# EAGLE schematic X8R analog sensor (EAGLE 6.4)
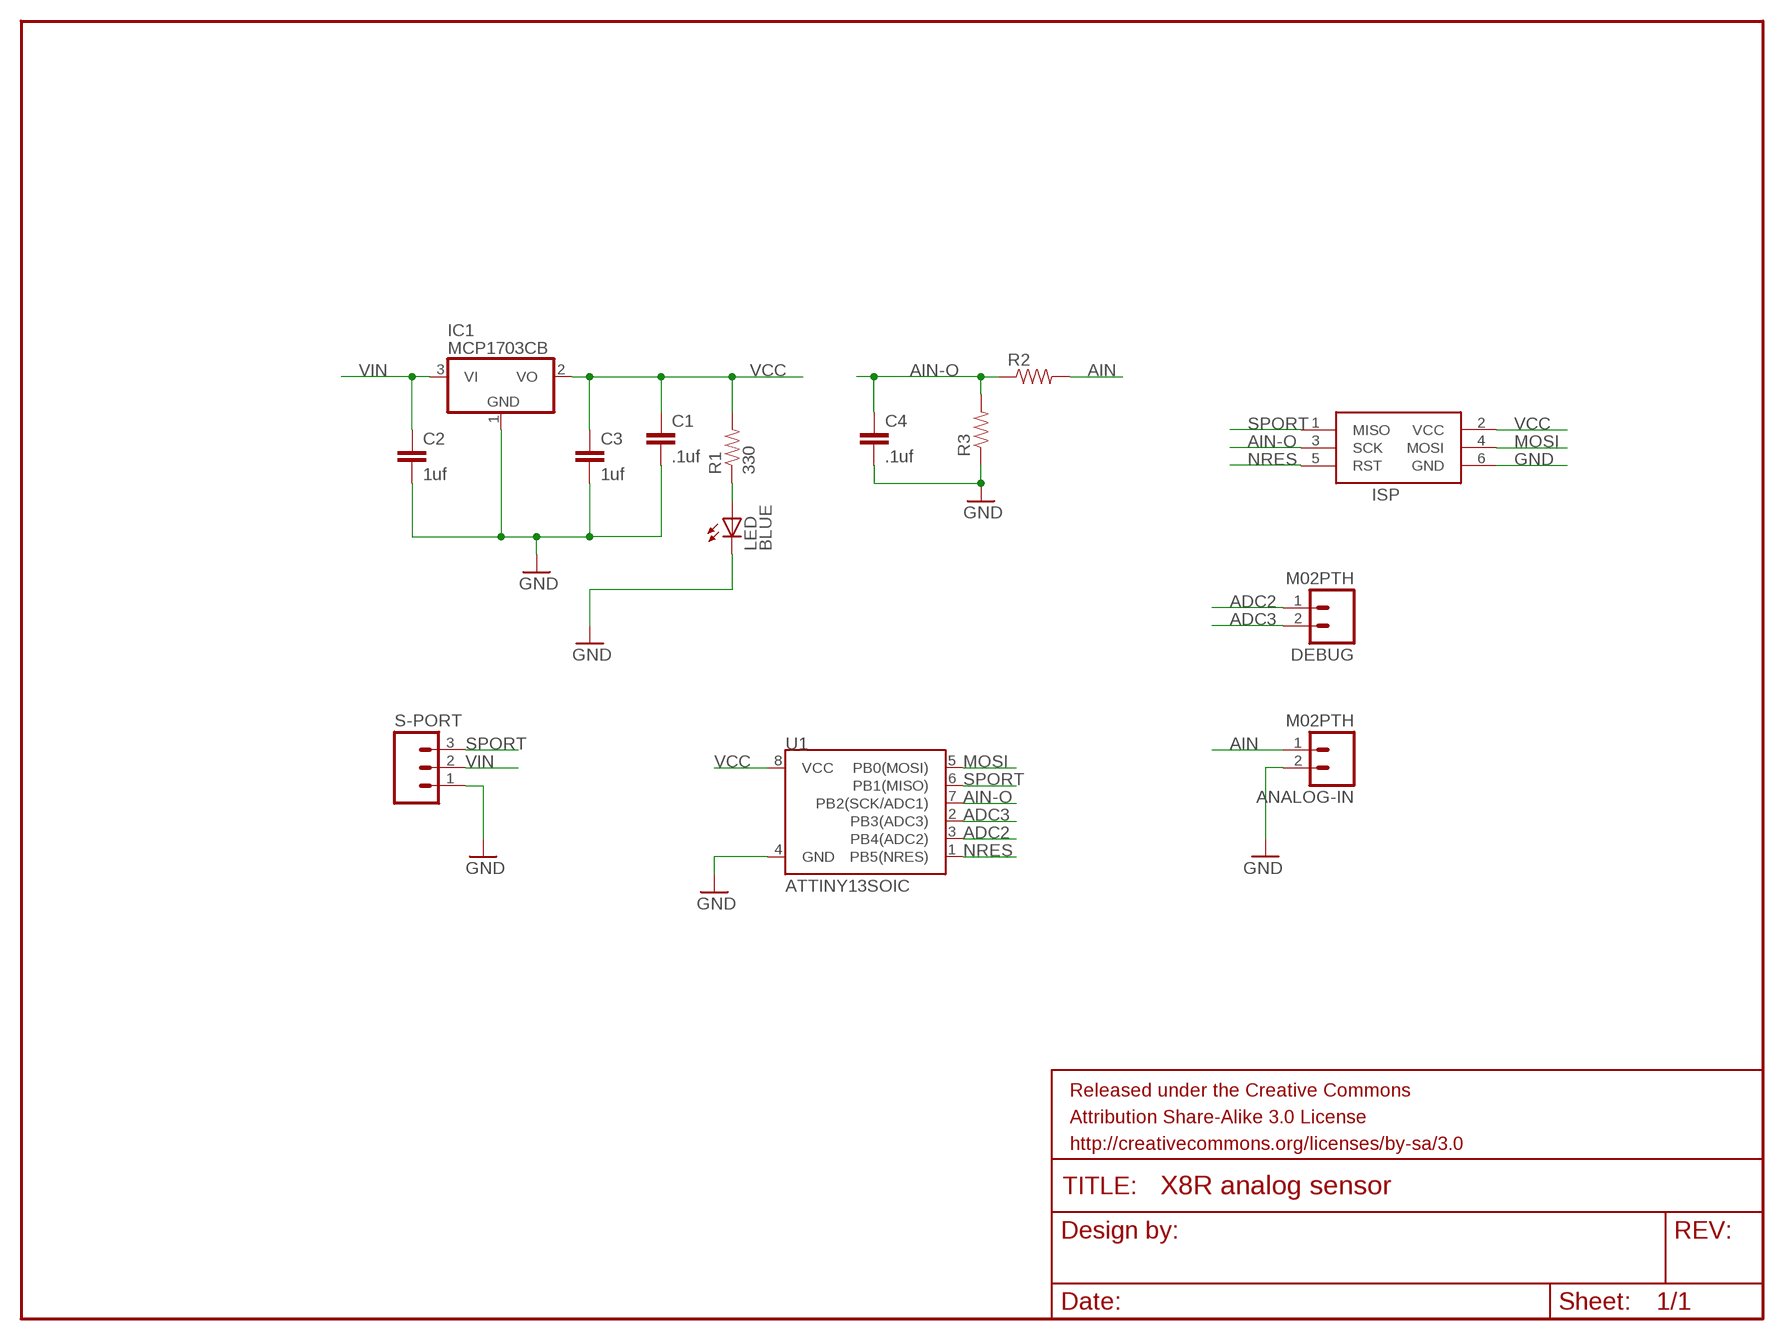
[diagram p0: schematic, sheet 1]

## Parts
ANALOG-IN  M02PTH  [1X02]
C1  .1uf  CAP0603-CAP  [0603-CAP]
C2  1uf  CAP0603-CAP  [0603-CAP]
C3  1uf  CAP0603-CAP  [0603-CAP]
C4  .1uf  CAP0603-CAP  [0603-CAP]
DEBUG  M02PTH  [1X02]
FRAME1  FRAME-LETTER  [CREATIVE_COMMONS]
IC1  MCP1703CB  [SOT23]
ISP  AVRISP-6  [AVRISP]
LED  BLUE  LED0603  [LED-0603]
R1  330  RESISTOR0603  [0603-RES]
R2  RESISTORPTH-1/6W  [1/6W-RES]
R3  RESISTORPTH-1/6W  [1/6W-RES]
S-PORT  M03PTH  [1X03]
U1  ATTINY13SOIC  [SO08]

## Nets
ADC2: DEBUG.1 U1.3(PB4(ADC2))
ADC3: DEBUG.2 U1.2(PB3(ADC3))
AIN: ANALOG-IN.1 R2.2
AIN-O: C4.1 ISP.3(SCK) R2.1 R3.2 U1.7(PB2(SCK/ADC1))
GND: ANALOG-IN.2 C1.2 C2.2 C3.2 C4.2 IC1.1(GND) ISP.6(GND) LED.C R3.1 S-PORT.1 U1.4(GND)
MOSI: ISP.4(MOSI) U1.5(PB0(MOSI))
N$7: LED.A R1.1
NRES: ISP.5(RST) U1.1(PB5(NRES))
SPORT: ISP.1(MISO) S-PORT.3 U1.6(PB1(MISO))
VCC: C1.1 C3.1 IC1.2(VO) ISP.2(VCC) R1.2 U1.8(VCC)
VIN: C2.1 IC1.3(VI) S-PORT.2

## Library data of the parts
ANALOG-IN DEBUG = SparkFun-Connectors:M02: Standard 2-pin 0.1" header. Use with - straight break away headers ( PRT-00116) - right angle break away headers (PRT-00553) - swiss pins (PRT-00743) - machine pins (PRT-00117) - female headers (PRT-00115) Molex polarized connector foot print use with: PRT-08233 with associated crimp pins and housings. 2.54_SCREWTERM for use with PRT-10571. 3.5mm Screw Terminal footprints for PRT-08084 5mm Screw Terminal footprints for use with PRT-08433
C1-C4 = SparkFun-Capacitors:CAP: Capacitor Standard 0603 ceramic capacitor, and 0.1" leaded capacitor.
FRAME1 = SparkFun-Aesthetics:FRAME-LETTER: Schematic Frame Standard 8.5x11 US Letter frame
IC1 = linear:MCP1703: 250 mA, 16V, Low Quiescent Current LDO Regulator Source: http://ww1.microchip.com/downloads/en/DeviceDoc/22049b.pdf
ISP = adafruit:AVRISP: AVR ISP HEADER Standard 6 pin header for AVR programming
LED = SparkFun-LED:LED: LEDs Standard schematic elements and footprints for 5mm, 3mm, 1206, and 0603 sized LEDs. 5mm - Spark Fun Electronics SKU : COM-00529 (and others)
R1 = SparkFun-Resistors:RESISTOR: Resistor Basic schematic elements and footprints for 0603, 1206, and PTH resistors.
R2 R3 = SparkFun-Passives:RESISTOR: Resistor Basic schematic elements and footprints for 0603, 1206, and PTH resistors.
S-PORT = SparkFun-Connectors:M03: Header 3 Standard 3-pin 0.1" header. Use with straight break away headers (SKU : PRT-00116), right angle break away headers (PRT-00553), swiss pins (PRT-00743), machine pins (PRT-00117), and female headers (PRT-00115). Molex polarized connector foot print use with SKU : PRT-08232 with associated crimp pins and housings.
U1 = SparkFun-DigitalIC:ATTINY13: Atmel 8-pin 1kB flash uC